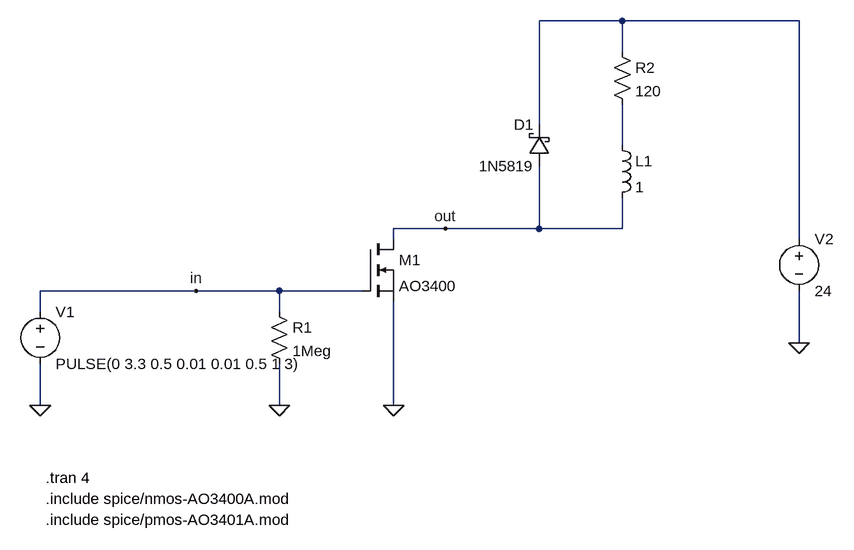
[diagram p0: schematic DOUT.asc]
DOUT.asc, the LTspice schematic file:
Version 4
SHEET 1 1560 680
WIRE 672 -160 544 -160
WIRE 944 -160 672 -160
WIRE 672 -112 672 -160
WIRE 544 0 544 -160
WIRE 672 32 672 -32
WIRE 400 160 320 160
WIRE 544 160 544 64
WIRE 544 160 400 160
WIRE 672 160 672 112
WIRE 672 160 544 160
WIRE 320 176 320 160
WIRE 944 176 944 -160
WIRE 16 256 -224 256
WIRE 144 256 16 256
WIRE 272 256 144 256
WIRE -224 288 -224 256
WIRE 144 288 144 256
WIRE 944 336 944 256
WIRE -224 432 -224 368
WIRE 144 432 144 368
WIRE 320 432 320 272
FLAG -224 432 0
FLAG 144 432 0
FLAG 320 432 0
FLAG 944 336 0
FLAG 400 160 out
FLAG 16 256 in
SYMBOL voltage -224 272 R0
WINDOW 123 0 0 Left 0
WINDOW 39 0 0 Left 0
SYMATTR InstName V1
SYMATTR Value PULSE(0 3.3 0.5 0.01 0.01 0.5 1 3)
SYMBOL res 128 272 R0
SYMATTR InstName R1
SYMATTR Value 1Meg
SYMBOL nmos 272 176 R0
SYMATTR InstName M1
SYMATTR Value AO3400
SYMATTR Prefix X
SYMBOL voltage 944 160 R0
WINDOW 123 0 0 Left 0
WINDOW 39 0 0 Left 0
SYMATTR InstName V2
SYMATTR Value 24
SYMBOL res 656 -128 R0
SYMATTR InstName R2
SYMATTR Value 120
SYMBOL schottky 560 64 R180
WINDOW 0 24 64 Left 2
WINDOW 3 24 0 Left 2
SYMATTR InstName D1
SYMATTR Value 1N5819
SYMATTR Description Diode
SYMATTR Type diode
SYMBOL ind 656 16 R0
SYMATTR InstName L1
SYMATTR Value 1
TEXT -216 544 Left 2 !.tran 4
TEXT -216 576 Left 2 !.include spice/nmos-AO3400A.mod
TEXT -216 608 Left 2 !.include spice/pmos-AO3401A.mod

The netlist it stands for:
* DOUT.asc
V1 in 0 PULSE(0 3.3 0.5 0.01 0.01 0.5 1 3)
R1 in 0 1Meg
XM1 out in 0 AO3400  ; pins D G S
V2 N001 0 24
R2 N001 N002 120
D1 out N001 1N5819
L1 N002 out 1
.model D D
.lib standard.dio
.tran 4
.include spice/nmos-AO3400A.mod
.include spice/pmos-AO3401A.mod
.backanno
.end

* Results of the author's LTspice run, read from the files saved beside the schematic
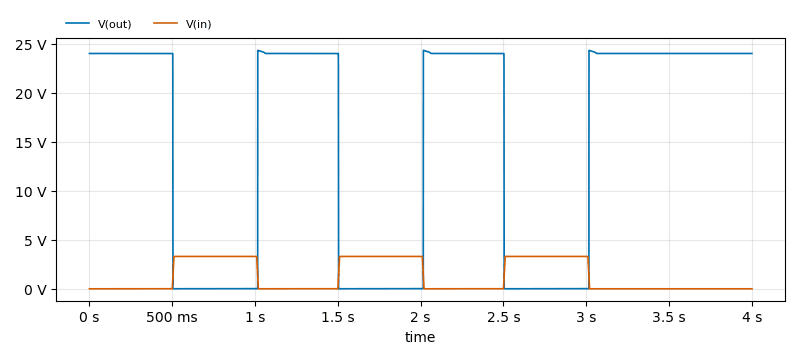
[diagram p1: Transient Analysis of DOUT.asc, plotted from the saved traces]
* Transient Analysis, 1 run:
*   V(out): min 3.221 mV, max 24.32 V, average 14.79 V, rms 18.84 V, last 24 V
*   V(in): min 0 V, max 3.3 V, average 1.262 V, rms 2.034 V, last 0 V